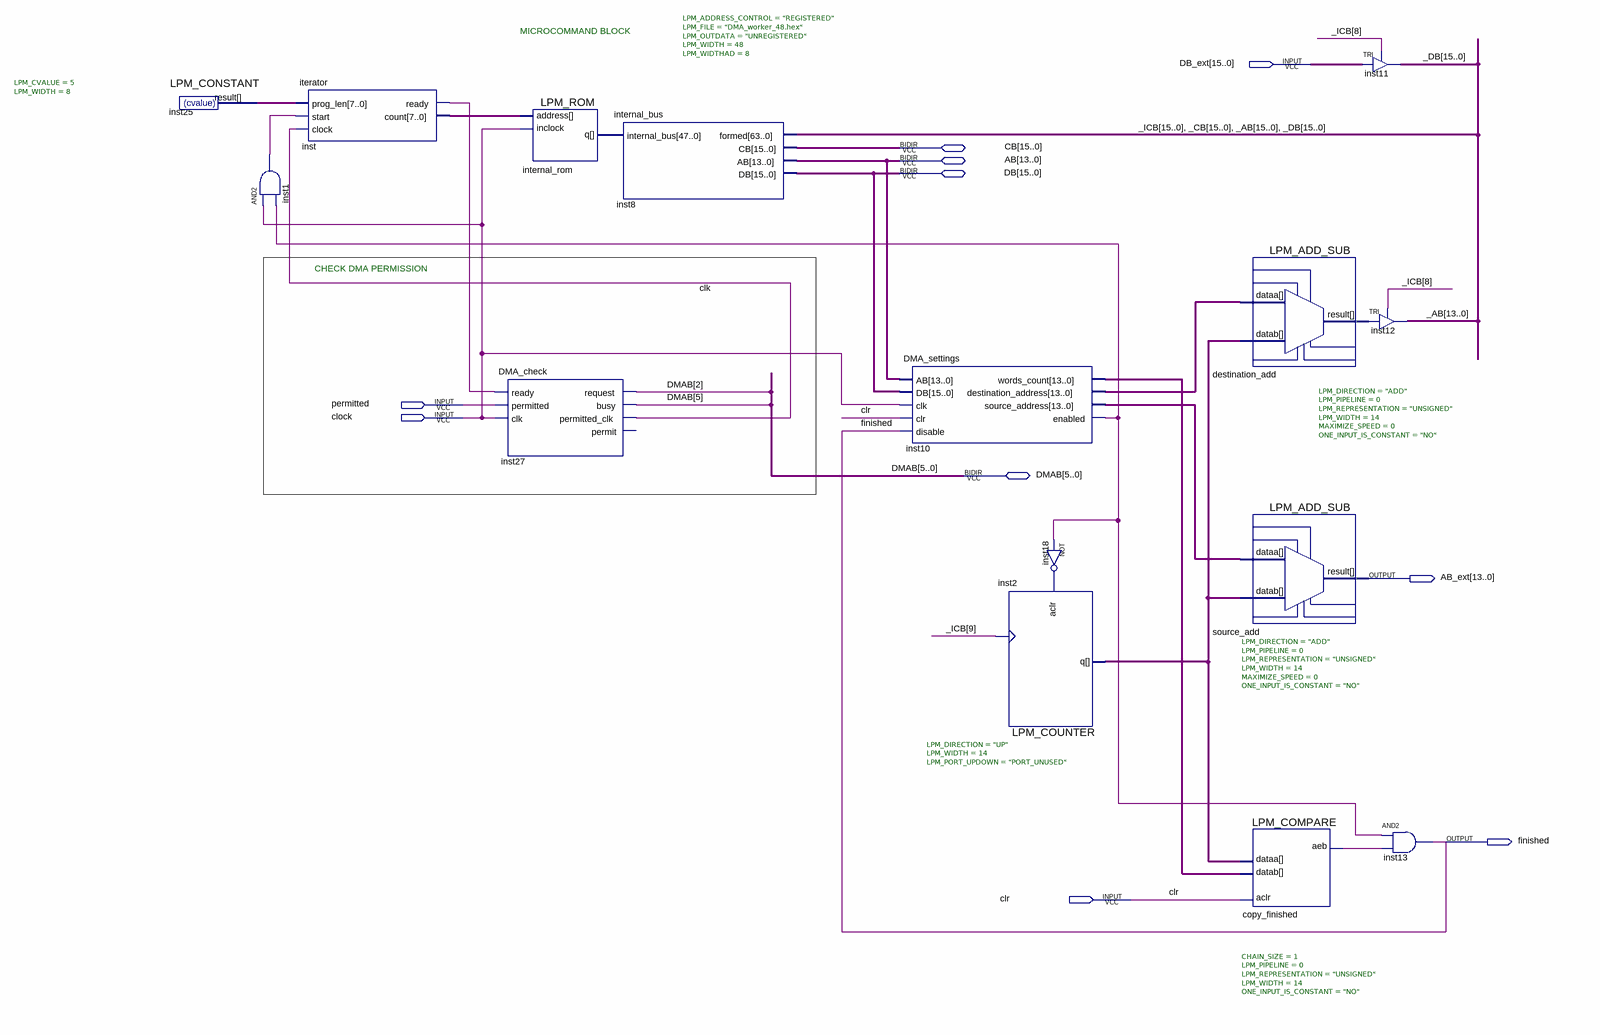
[diagram p0: schematic sheet]
// Quartus schematic DMA_worker.bdf as structural Verilog: 15 symbols, 10 pins
module DMA_worker (
  input  [15:0] DB_ext,
  input  permitted,
  input  clock,
  input  clr,
  inout  [15:0] CB,
  inout  [13:0] AB,
  inout  [15:0] DB,
  inout  [5:0] DMAB,
  output [13:0] AB_ext,
  output finished
);

  wire clk, copy_finished_aeb, inst1_out, inst10_enabled, inst18_out, inst_ready;
  wire [7:0] inst25_result, inst_count;
  wire [13:0] destination_add_result, inst2_q, inst10_destination_address, inst10_source_address,
       inst10_words_count;
  wire [15:0] _AB, _CB, _DB, _ICB;
  wire [47:0] internal_rom_q;

  LPM_CONSTANT #(.LPM_CVALUE(5), .LPM_WIDTH(8)) inst25 (.result(inst25_result));
  and inst1 (inst1_out, clock, inst10_enabled);
  iterator inst (.prog_len(inst25_result), .start(inst1_out), .clock(clk), .ready(inst_ready), .count(inst_count));
  DMA_check inst27 (
    .ready(inst_ready), .permitted(permitted), .clk(clock), .request(DMAB[2]), .busy(DMAB[5]),
    .permitted_clk(clk));  // open: permit
  LPM_ROM #(.LPM_ADDRESS_CONTROL("REGISTERED"), .LPM_FILE("DMA_worker_48.hex"), .LPM_OUTDATA("UNREGISTERED"), .LPM_WIDTH(48), .LPM_WIDTHAD(8)) internal_rom (
    .address(inst_count), .inclock(clock), .q(internal_rom_q));
  internal_bus inst8 (.internal_bus(internal_rom_q), .formed({_ICB, _CB, _AB, _DB}), .CB(CB), .AB(AB), .DB(DB));
  DMA_settings inst10 (
    .AB(AB), .DB(DB), .clk(clock), .clr(clr), .\disable (finished), .words_count(inst10_words_count),
    .destination_address(inst10_destination_address), .source_address(inst10_source_address),
    .enabled(inst10_enabled));
  LPM_COUNTER #(.LPM_DIRECTION("UP"), .LPM_WIDTH(14), .LPM_PORT_UPDOWN("PORT_UNUSED")) inst2 (
    .clock(_ICB[9]), .aclr(inst18_out), .q(inst2_q));
  not inst18 (inst18_out, inst10_enabled);
  LPM_ADD_SUB #(.LPM_DIRECTION("ADD"), .LPM_PIPELINE(0), .LPM_REPRESENTATION("UNSIGNED"), .LPM_WIDTH(14), .MAXIMIZE_SPEED(0), .ONE_INPUT_IS_CONSTANT("NO")) destination_add (
    .datab(inst2_q), .dataa(inst10_destination_address), .result(destination_add_result));
  LPM_ADD_SUB #(.LPM_DIRECTION("ADD"), .LPM_PIPELINE(0), .LPM_REPRESENTATION("UNSIGNED"), .LPM_WIDTH(14), .MAXIMIZE_SPEED(0), .ONE_INPUT_IS_CONSTANT("NO")) source_add (
    .datab(inst2_q), .dataa(inst10_source_address), .result(AB_ext));
  LPM_COMPARE #(.CHAIN_SIZE(1), .LPM_PIPELINE(0), .LPM_REPRESENTATION("UNSIGNED"), .LPM_WIDTH(14), .ONE_INPUT_IS_CONSTANT("NO")) copy_finished (
    .dataa(inst2_q), .datab(inst10_words_count), .aclr(clr), .aeb(copy_finished_aeb));
  TRI inst11[15:0] (.IN(DB_ext), .OE(_ICB[8]), .OUT(_DB));
  TRI inst12[13:0] (.IN(destination_add_result), .OE(_ICB[8]), .OUT(_AB[13:0]));
  and inst13 (finished, inst10_enabled, copy_finished_aeb);

  // Notes on the sheet:
  //   MICROCOMMAND BLOCK
  //   CHECK DMA PERMISSION
endmodule
